# EAGLE design powersupply (EAGLE 5.11)
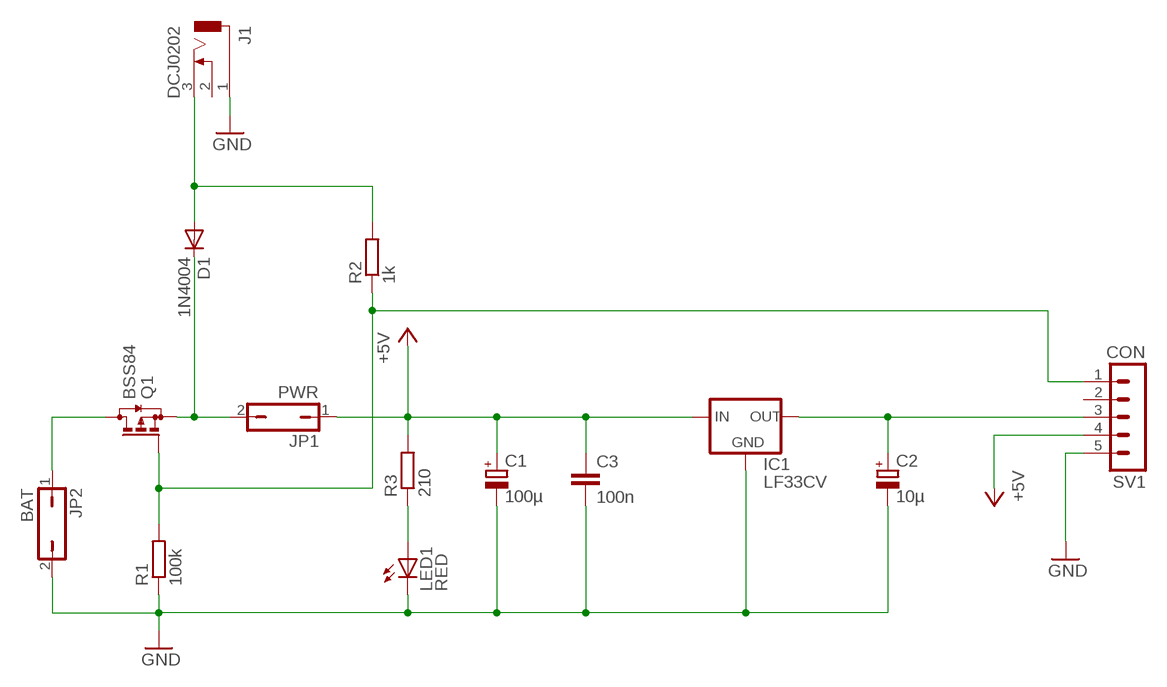
[diagram p0: schematic, sheet 1]

## Parts
C1  100µ  CPOL-EUE2.5-6  [E2,5-6]
C2  10µ  CPOL-EUE2.5-6  [E2,5-6]
C3  100n  C-EU025-024X044  [C025-024X044]
D1  1N4004  [DO41-10]
IC1  LF33CV  LFXXCVS  [TO220S]
J1  DCJ0202  [DCJ0202]
JP1  PWR  JP1Q  [JP1]
JP2  BAT  JP1Q  [JP1]
LED1  RED  LED3MM  [LED3MM]
Q1  BSS84  [SOT23]
R1  100k  R-EU_0204/7  [0204/7]
R2  1k  R-EU_0204/7  [0204/7]
R3  210  R-EU_0204/7  [0204/7]
SV1  CON  MA05-1  [MA05-1]

## Nets
+5V: C1.+ C3.1 IC1.1(IN) JP1.1 R3.2 SV1.4
GND: C1.- C2.- C3.2 IC1.2(GND) J1.1 JP2.2 LED1.K(C) R1.1 SV1.5
N$1: Q1.1(G) R1.2 R2.1 SV1.1
N$2: D1.A J1.3 R2.2
N$4: D1.C JP1.2 Q1.2(S)
N$5: C2.+ IC1.3(OUT) SV1.3
N$9: LED1.A R3.1
N$10: JP2.1 Q1.3(D)
Unconnected: J1.2 SV1.2

## Library data of the parts
C1 C2 = rcl:CPOL-EU: POLARIZED CAPACITOR, European symbol
C3 = rcl:C-EU: CAPACITOR, European symbol
D1 = diode:1N4004: DIODE general purpose rectifier, 1 A
IC1 = lf33:LFXXCV: VOLTAGE REGULATOR
J1 = con-jack:DCJ0202: DC POWER JACK Source: DCJ0202.pdf; OC_FARNELL: unknown; OC_NEWARK: unknown
JP1 JP2 = jumper:JP1Q: JUMPER
LED1 = led:LED: LED OSRAM: - CHIPLED LG R971, LG N971, LY N971, LG Q971, LY Q971, LO R971, LY R971 LH N974, LH R974 LS Q976, LO Q976, LY Q976 LO Q996 - Hyper CHIPLED LW Q18S LB Q993, LB Q99A, LB R99A - SideLED LS A670, LO A670, LY A670, LG A670, LP A670 LB A673, LV A673, LT A673, LW A673 LH A674 LY A675 LS A676, LA A676, LO A676, LY A676, LW A676 LS A679, LY A679, LG A679 - Hyper Micro SIDELED® LS Y876, LA Y876, LO Y876, LY Y876 LT Y87S - SmartLED LW L88C, LW L88S LB L89C, LB L89S, LG L890 LS L89K, LO L89K, LY L89K LS L896, LA L896, LO L896, LY L896 - TOPLED LS T670, LO T670, LY T670, LG T670, LP T670 LSG T670, LSP T670, LSY T670, LOP T670, LYG T670 LG T671, LOG T671, LSG T671 LB T673, LV T673, LT T673, LW T673 LH T674 LS T676, LA T676, LO T676, LY T676, LB T676, LH T676, LSB T676, LW T676 LB T67C, LV T67C, LT T67C, LS T67K, LO T67K, LY T67K, LW E67C LS E67B, LA E67B, LO E67B, LY E67B, LB E67C, LV E67C, LT E67C LW T67C LS T679, LY T679, LG T679 LS T770, LO T770, LY T770, LG T770, LP T770 LB T773, LV T773, LT T773, LW T773 LH T774 LS E675, LA E675, LY E675, LS T675 LS T776, LA T776, LO T776, LY T776, LB T776 LHGB T686 LT T68C, LB T68C - Hyper Mini TOPLED® LB M676 - Mini TOPLED Santana® LG M470 LS M47K, LO M47K, LY M47K Source: http://www.osram.convergy.de LUXEON: - LUMILED® LXK2-PW12-R00, LXK2-PW12-S00, LXK2-PW14-U00, LXK2-PW14-V00 LXK2-PM12-R00, LXK2-PM12-S00, LXK2-PM14-U00 LXK2-PE12-Q00, LXK2-PE12-R00, LXK2-PE12-S00, LXK2-PE14-T00, LXK2-PE14-U00 LXK2-PB12-K00, LXK2-PB12-L00, LXK2-PB12-M00, LXK2-PB14-N00, LXK2-PB14-P00, LXK2-PB14-Q00 LXK2-PR12-L00, LXK2-PR12-M00, LXK2-PR14-Q00, LXK2-PR14-R00 LXK2-PD12-Q00, LXK2-PD12-R00, LXK2-PD12-S00 LXK2-PH12-R00, LXK2-PH12-S00 LXK2-PL12-P00, LXK2-PL12-Q00, LXK2-PL12-R00 Source: www.luxeon.com KINGBRIGHT: KA-3528ASYC Source: www.kingbright.com
Q1 = transistor-small-signal:BSS84: P-CHANNEL MOS FET
R1-R3 = rcl:R-EU_: RESISTOR, European symbol
SV1 = con-lstb:MA05-1: PIN HEADER; OC_FARNELL: unknown; OC_NEWARK: unknown

## Board
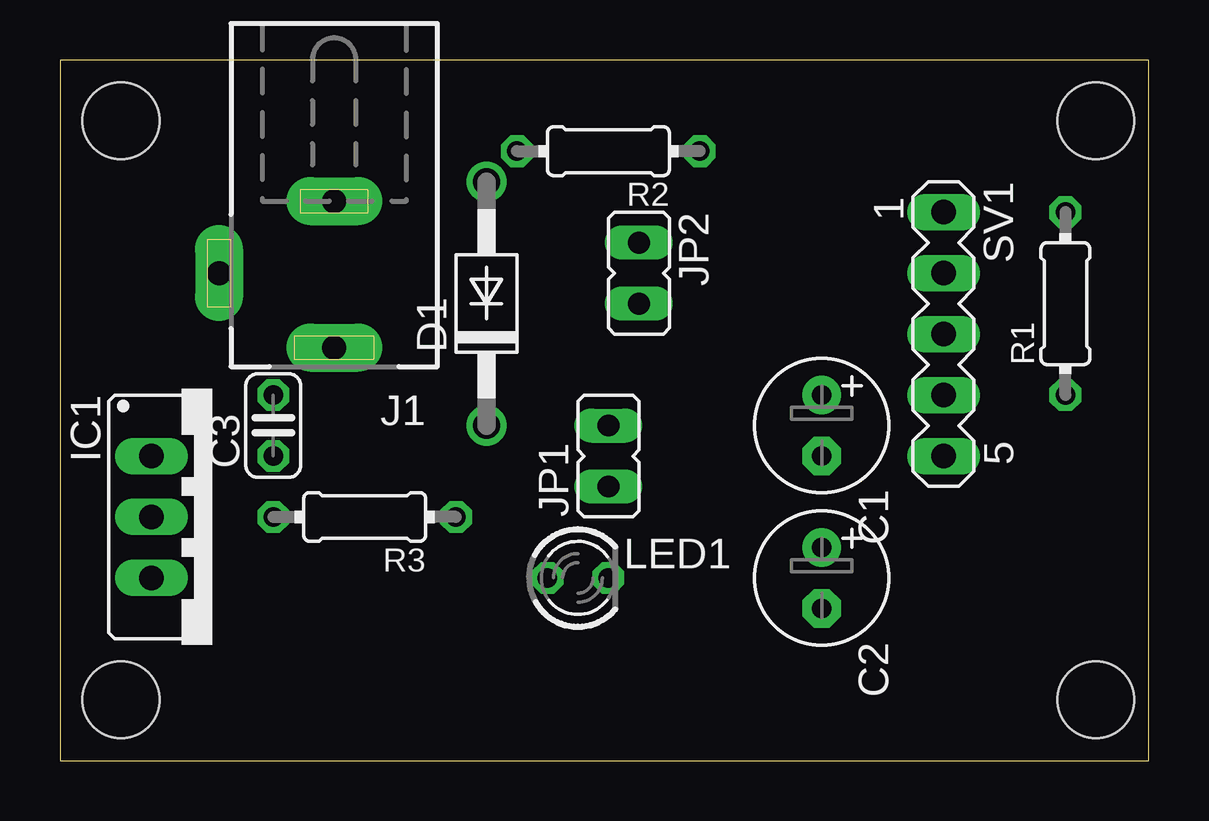
[diagram p1: board, top side]
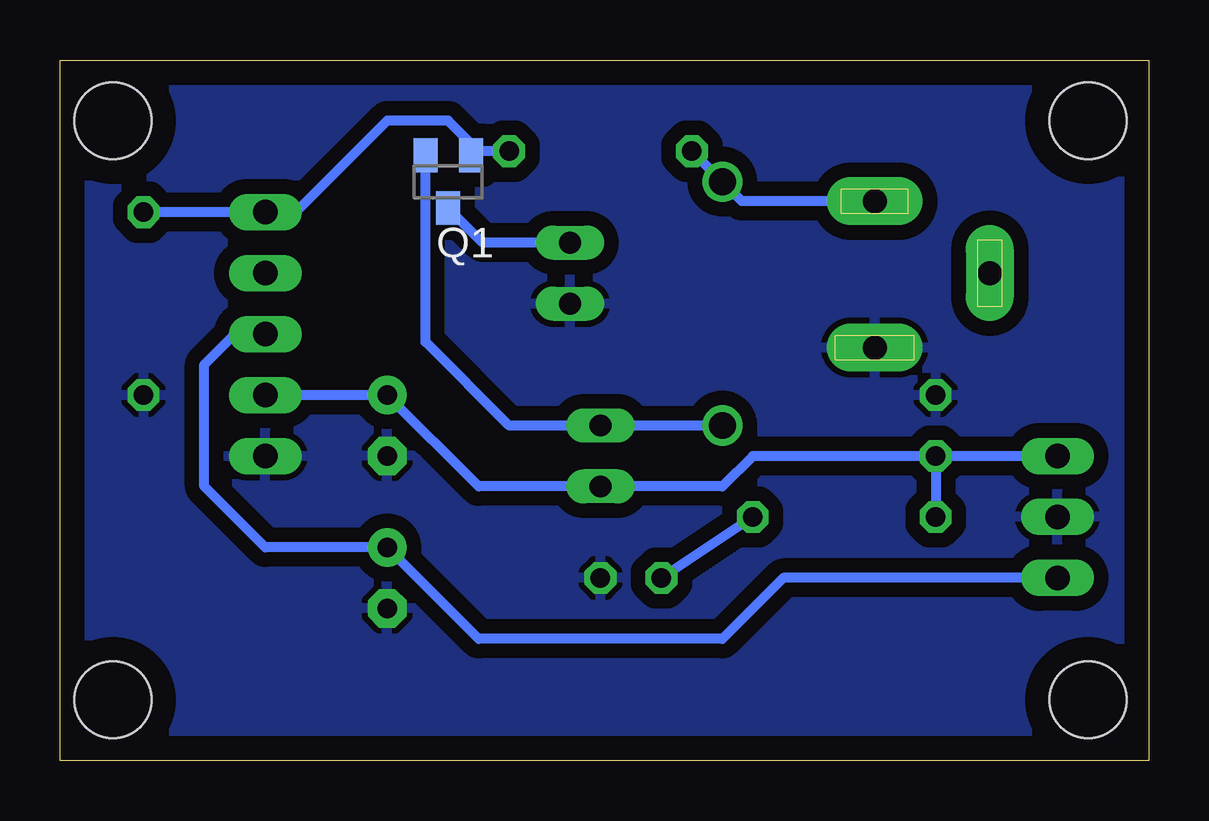
[diagram p2: board, bottom side, seen from below]

Size 45.39 x 29.2 mm. Coordinates in mm from the lower left corner, seen from the top.
Outline: 0,0 45.39,0 45.39,29.2 0,29.2 0,0
Copper layers (1*16): Top 0.035mm / dielectric 1.5mm / Bottom 0.035mm
Design rules "default": minimum track width 10mil, minimum drill 24mil, track to track 8mil, track to pad 8mil, pad to pad 8mil, via to via 8mil, smd to smd 8mil, copper to edge 40mil, drill to drill 8mil, minimum pad ring 10mil, minimum via ring 8mil, stop-mask expansion 4mil, vias tented up to drill 0mil, thermal gap 10mil
Holes 3.2 mm at 2.54,26.67 43.18,26.67 43.18,2.54 2.54,2.54

### Footprints (pad centres in the part's own frame; a part is rotated, then mirrored left to right if it is on the bottom)
E2,5-6 = drill 0.813 pad 1.6 round: + -1.27,0 | drill 0.813 pad 1.6 octagon: - 1.27,0
C025-024X044 = drill 0.813 octagon: 1 -1.27,0; 2 1.27,0
DO41-10 = drill 1.118 round: A 5.08,0; C -5.08,0
TO220S = drill 1.016 long: 1 -2.54,-2.54; 2 0,-2.54; 3 2.54,-2.54
DCJ0202 = drill 1 pad 2 long: 1 0,3.1; 2 4.8,0; 3 0,-3
JP1 = drill 0.914 long: 1 0,-1.27; 2 0,1.27
LED3MM = drill 0.813 octagon: A -1.27,0; K 1.27,0
SOT23 = smd 1 x 1.4: 1 -0.95,-1.1; 2 0.95,-1.1; 3 0,1.1
0204/7 = drill 0.813 octagon: 1 -3.81,0; 2 3.81,0
MA05-1 = drill 1.016 long: 1 -5.08,0; 2 -2.54,0; 3 0,0; 4 2.54,0; 5 5.08,0

### Placement (x,y rotation side)
C1  31.75,13.97 270 top
C2  31.75,7.62 270 top
C3  8.89,13.97 90 top
D1  17.78,19.05 90 top
IC1  6.35,10.16 270 top
J1  11.43,20.32 180 top
JP1  22.86,12.7 0 top
JP2  24.13,20.32 180 top
LED1  21.59,7.62 0 top
Q1  29.21,24.13 180 bottom
R1  41.91,19.05 90 top
R2  22.86,25.4 180 top
R3  12.7,10.16 180 top
SV1  36.83,17.78 270 top

### Tracks (layer width: path | path; a pad name or v marks a point on that pad's centre or on a via)
+5V
  Bottom 0.406: C3.1 R3.2 | IC1.1 C3.1 | C3.1 16.51,12.7 17.78,11.43 JP1.1 27.94,11.43 C1.+ SV1.4
GND
  pour Bottom (isolate 0.61): 0,29.21 45.72,29.21 45.72,0 0,0
N$1
  Bottom 0.406: R2.1 27.94,25.4 | 28.09,25.4 28.26,25.4 Q1.1 28.09,25.4 | R1.2 SV1.1 35.56,22.86 31.75,26.67 29.21,26.67 27.94,25.4 | 27.94,25.4 28.09,25.4
N$2
  Bottom 0.406: J1.3 16.97,23.32 D1.A R2.2
N$4
  Bottom 0.406: D1.C JP1.2 26.67,13.97 30.16,17.46 Q1.2
N$5
  Bottom 0.406: IC1.3 15.24,7.62 17.78,5.08 27.94,5.08 C2.+ 36.83,8.89 39.37,11.43 39.37,16.51 38.1,17.78 SV1.3
N$9
  Bottom 0.406: LED1.A R3.1
N$10
  Bottom 0.406: 29.21,22.86 Q1.3 27.77,21.59 JP2.1